# Altium schematic sheet nixie_power.SchDoc: Nixie Power
size A4; Author: Manuel Diaz Alonso; Address1: 2; Address2: 2; Revision: 1; SheetNumber: 1; SheetTotal: 2
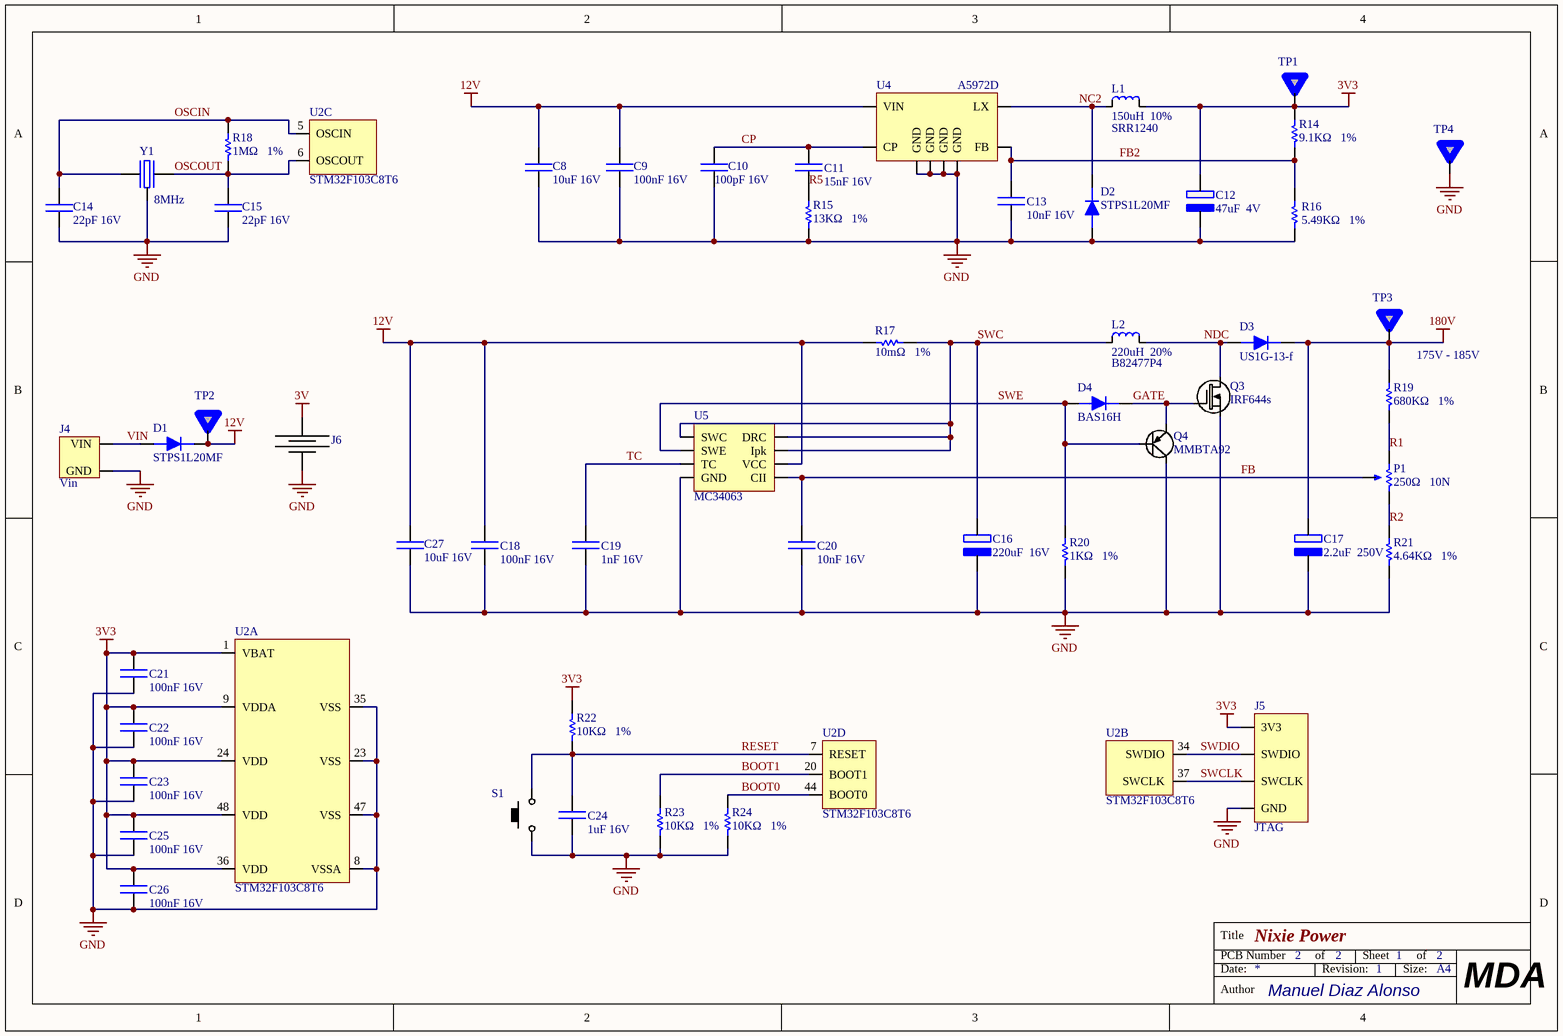
[diagram p0: nixie_power.SchDoc]

## Parts
C8  10uF 16V  [0603]
C9  100nF 16V  [0603]
C10  100pF 16V  [0603]
C11  15nF 16V  [0603]
C12  47uF  4V  [AVX-B-CASE]
C13  10nF 16V  [0603]
C14  22pF 16V  [0603]
C15  22pF 16V  [0603]
C16  220uF  16V  [CAP-SIZE-F]
C17  2.2uF  250V  [CAP-SIZE-F]
C18  100nF 16V  [0603]
C19  1nF 16V  [0603]
C20  10nF 16V  [0603]
C21  100nF 16V  [0603]
C22  100nF 16V  [0603]
C23  100nF 16V  [0603]
C24  1uF 16V  [0603]
C25  100nF 16V  [0603]
C26  100nF 16V  [0603]
C27  10uF 16V  [0603]
D1  STPS1L20MF  [DO-222AA]
D2  STPS1L20MF  [DO-222AA]
D3  US1G-13-f  [SMA]
D4  BAS16H  [SOD-123F]
J4  Vin  [HEADERx2_POL]
J5  JTAG  [PIN_1X4_HDR_RA]
J6  BAT  [120591-1]  (value not drawn)
L1  150uH  10%  [SRR1240]
L2  220uH  20%  [12.5x12.5]
P1  250Ω   10N  [3006P]
Q3  IRF644s  [TO263-3S]
Q4  MMBTA92  [SOT-23]
R14  9.1KΩ   1%  [0603]
R15  13KΩ   1%  [0603]
R16  5.49KΩ   1%  [0603]
R17  10mΩ   1%  [0603]
R18  1MΩ   1%  [0603]
R19  680KΩ   1%  [0603]
R20  1KΩ   1%  [0603]
R21  4.64KΩ   1%  [0603]
R22  10KΩ   1%  [0603]
R23  10KΩ   1%  [0603]
R24  10KΩ   1%  [0603]
S1  RESET  [FSMSM]  (value not drawn)
TP1  TEST-POINT  [Test_Point]  (value not drawn)
TP2  TEST-POINT  [Test_Point]  (value not drawn)
TP3  TEST-POINT  [Test_Point]  (value not drawn)
TP4  TEST-POINT  [Test_Point]  (value not drawn)
U2  STM32F103C8T6  [LQFP48]  (parts A,B,C,D of 9)
U4  A5972D  [SOIC-8]
U5  MC34063  [SOIC-8]
Y1  8MHz  [ABM3B]

## Nets
3V: J6.1(+)
3V3: C12.2 C21.1 C22.1 C23.1 C25.1 C26.1 J5.1(3V3) L1.2 R14.2 R22.2 TP1.1 U2.1(VBAT) U2.9(VDDA) U2.24(VDD) U2.36(VDD) U2.48(VDD)
12V: C8.2 C9.2 C18.2 C27.2 D1.2 R17.1 TP2.1 U4.8(VIN) U5.6(VCC)
180V: C17.2 D3.2 R19.2 TP3.1
GND: C8.1 C9.1 C10.1 C12.1 C13.1 C14.1 C15.1 C16.1 C17.1 C18.1 C19.1 C20.1 C21.2 C22.2 C23.2 C24.1 C25.2 C26.2 C27.1 D2.1 J4.2(GND) J5.4(GND) J6.2(-) Q3.2(S) Q4.3(C) R15.1 R16.2 R20.1 R21.1 R23.1 R24.1 S1.2 TP4.1 U2.8(VSSA) U2.23(VSS) U2.35(VSS) U2.47(VSS) U4.2(GND) U4.3(GND) U4.6(GND) U4.7(GND) U5.4(GND) Y1.3
BOOT0: R24.2 U2.44(BOOT0)
BOOT1: R23.2 U2.20(BOOT1)
CP: C10.2 C11.2 U4.4(CP)
FB: C20.2 P1.2 U5.5(CII)
FB2: C13.2 R14.1 R16.1 U4.5(FB)
GATE: D4.2 Q3.1(G) Q4.2(E)
NC2: D2.2 L1.1 U4.1(LX)
NDC: D3.1 L2.2 Q3.3(D)
OSCIN: C14.2 R18.2 U2.5(OSCIN) Y1.1
OSCOUT: C15.2 R18.1 U2.6(OSCOUT) Y1.2
R1: P1.3 R19.1
R2: P1.1 R21.2
R5: C11.1 R15.2
RESET: C24.2 R22.1 S1.1 U2.7(RESET)
SWC: C16.2 L2.1 R17.2 U5.1(SWC) U5.7(Ipk) U5.8(DRC)
SWCLK: J5.3(SWCLK) U2.37(SWCLK)
SWDIO: J5.2(SWDIO) U2.34(SWDIO)
SWE: D4.1 Q4.1(B) R20.2 U5.2(SWE)
TC: C19.2 U5.3(TC)
VIN: D1.1 J4.1(VIN)

## Notes on the sheet
- (near L1) SRR1240
- (near L2) B82477P4
- 175V - 185V
- Title
- PCB Number
- Date:
- of
- Revision:
- Sheet
- Size:
- A4
- Author
- MDA

## Library data of the parts
C8-C11 C13-C15 C18-C27 = CAP
C12 C16 C17 = CAP_pol
D1-D4 = DIO
J4 = Vin: 282837-2
J5 = JTAG: TSW-104-08-F-S-RA
J6 = BAT: CR2032
L1 = IND: SRR1240
L2 = IND: B82477P4
P1 = POTE
Q3 = N-MOS
Q4 = PNP
R14-R24 = RES
S1 = BUTTON
Y1 = Cristal: ABM3B